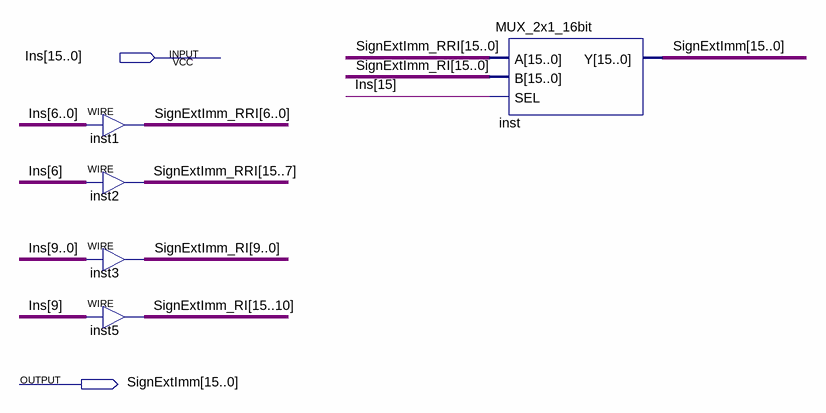
[diagram p0: schematic sheet]
// Quartus schematic Imm_Define.bdf as structural Verilog: 5 symbols, 2 pins
module Imm_Define (
  input  [15:0] Ins,
  output [15:0] SignExtImm
);

  wire [15:0] SignExtImm_RI, SignExtImm_RRI;

  assign SignExtImm_RRI[6:0] = Ins[6:0];  // WIRE inst1
  assign SignExtImm_RRI[15:7] = {9{Ins[6]}};  // WIRE inst2
  assign SignExtImm_RI[9:0] = Ins[9:0];  // WIRE inst3
  assign SignExtImm_RI[15:10] = {6{Ins[9]}};  // WIRE inst5
  MUX_2x1_16bit inst (.A(SignExtImm_RRI), .B(SignExtImm_RI), .SEL(Ins[15]), .Y(SignExtImm));
endmodule
